# Altium project RFC_MB.PrjPcb (part 6 of 7)

## Sheet SlowChans.SchDoc
size 594 x 420 mm; Address1: Address1; Address2: Address2; Address3: Address3; Address4: Address4; SheetNumber: 1; Scale: 1:1; Разраб.: Иванов; Обозначение документа: АБВГ.123456.001 Э3; Пров.: Петров; Утв.: Сидоров; Наименование организации: ОАО "Концерн "МПО-Гидроприбор"; Перв. применение: АБВГ.123456.000; Наименование изделия 1: Плата; Наименование изделия 2: Схема электрическая; Наименование изделия 3: принципиальная; Нач. отд.: Нач. отд.; Фамилия нач. отд.: Сидоров
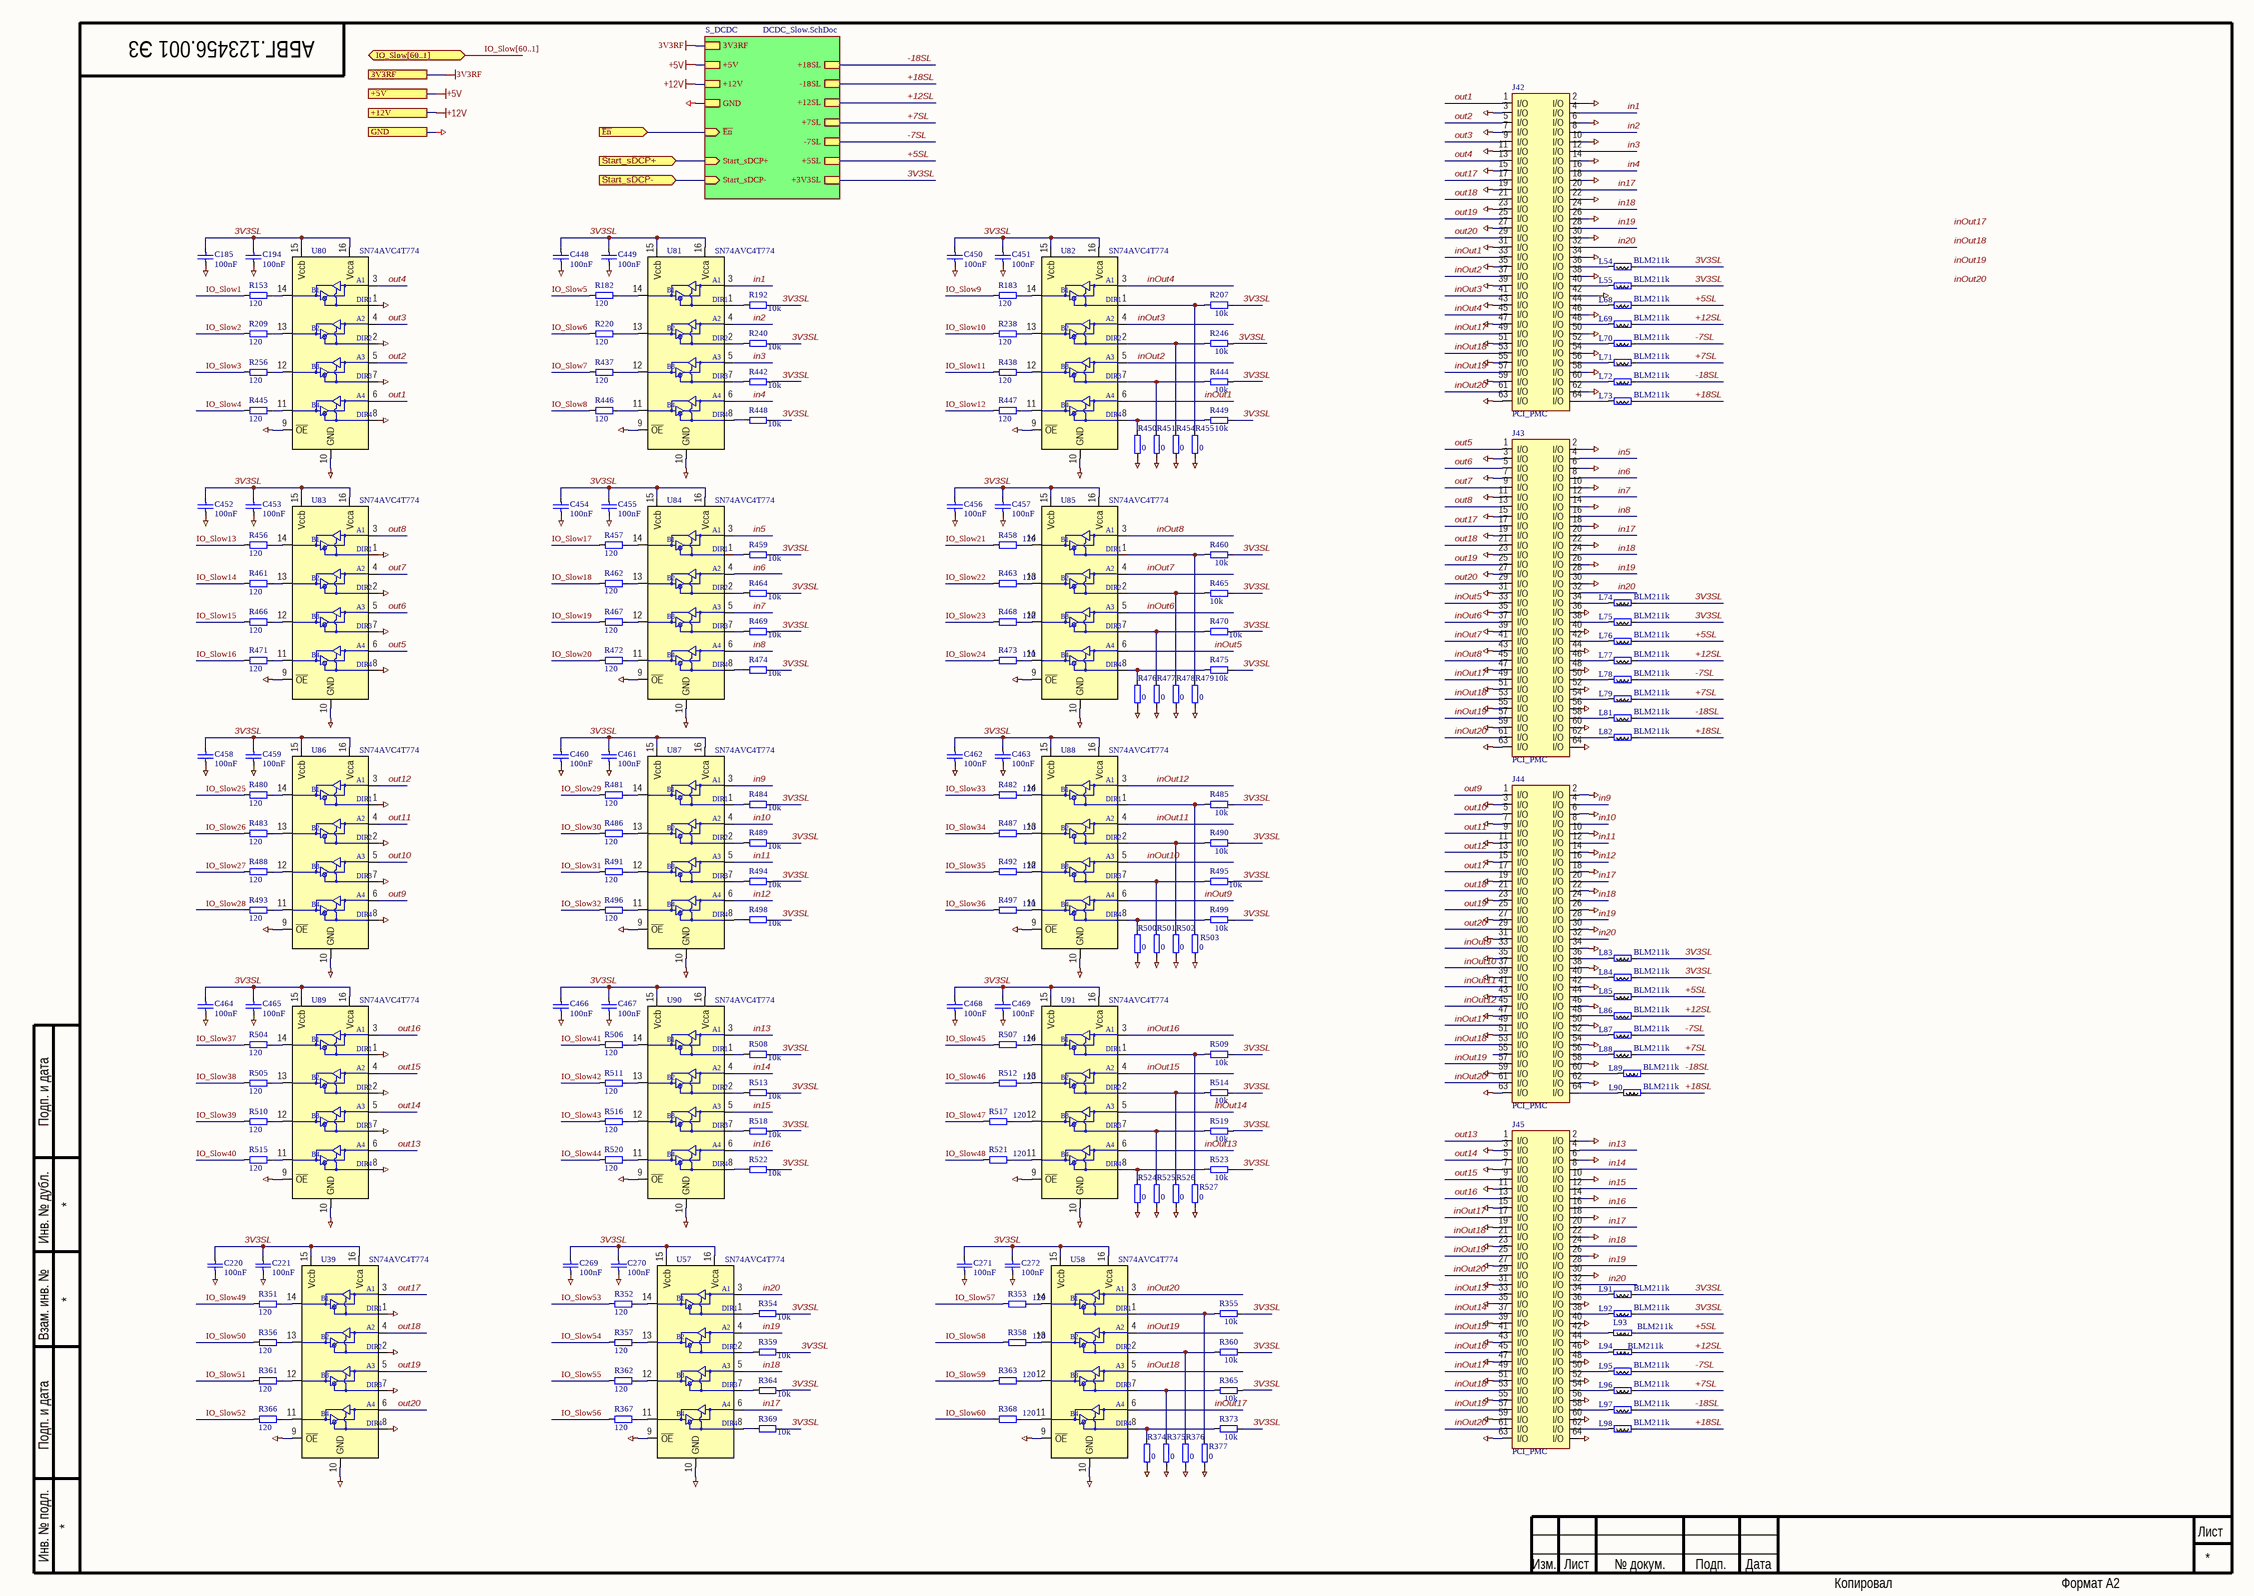
[diagram p21: SlowChans.SchDoc]

### Parts
C185  100nF  [SMD0805CAP]
C194  100nF  [SMD0805CAP]
C220  100nF  [SMD0805CAP]
C221  100nF  [SMD0805CAP]
C269  100nF  [SMD0805CAP]
C270  100nF  [SMD0805CAP]
C271  100nF  [SMD0805CAP]
C272  100nF  [SMD0805CAP]
C448  100nF  [SMD0805CAP]
C449  100nF  [SMD0805CAP]
C450  100nF  [SMD0805CAP]
C451  100nF  [SMD0805CAP]
C452  100nF  [SMD0805CAP]
C453  100nF  [SMD0805CAP]
C454  100nF  [SMD0805CAP]
C455  100nF  [SMD0805CAP]
C456  100nF  [SMD0805CAP]
C457  100nF  [SMD0805CAP]
C458  100nF  [SMD0805CAP]
C459  100nF  [SMD0805CAP]
C460  100nF  [SMD0805CAP]
C461  100nF  [SMD0805CAP]
C462  100nF  [SMD0805CAP]
C463  100nF  [SMD0805CAP]
C464  100nF  [SMD0805CAP]
C465  100nF  [SMD0805CAP]
C466  100nF  [SMD0805CAP]
C467  100nF  [SMD0805CAP]
C468  100nF  [SMD0805CAP]
C469  100nF  [SMD0805CAP]
J42  PCI_PMC  [TYCO_120521-1]
J43  PCI_PMC  [TYCO_120521-1]
J44  PCI_PMC  [TYCO_120521-1]
J45  PCI_PMC  [TYCO_120521-1]
L54  BLM211k  [RESC2012X50N]
L55  BLM211k  [RESC2012X50N]
L68  BLM211k  [RESC2012X50N]
L69  BLM211k  [RESC2012X50N]
L70  BLM211k  [RESC2012X50N]
L71  BLM211k  [RESC2012X50N]
L72  BLM211k  [RESC2012X50N]
L73  BLM211k  [RESC2012X50N]
L74  BLM211k  [RESC2012X50N]
L75  BLM211k  [RESC2012X50N]
L76  BLM211k  [RESC2012X50N]
L77  BLM211k  [RESC2012X50N]
L78  BLM211k  [RESC2012X50N]
L79  BLM211k  [RESC2012X50N]
L81  BLM211k  [RESC2012X50N]
L82  BLM211k  [RESC2012X50N]
L83  BLM211k  [RESC2012X50N]
L84  BLM211k  [RESC2012X50N]
L85  BLM211k  [RESC2012X50N]
L86  BLM211k  [RESC2012X50N]
L87  BLM211k  [RESC2012X50N]
L88  BLM211k  [RESC2012X50N]
L89  BLM211k  [RESC2012X50N]
L90  BLM211k  [RESC2012X50N]
L91  BLM211k  [RESC2012X50N]
L92  BLM211k  [RESC2012X50N]
L93  BLM211k  [RESC2012X50N]
L94  BLM211k  [RESC2012X50N]
L95  BLM211k  [RESC2012X50N]
L96  BLM211k  [RESC2012X50N]
L97  BLM211k  [RESC2012X50N]
L98  BLM211k  [RESC2012X50N]
R153  120  [SMD0805RES]
R182  120  [SMD0805RES]
R183  120  [SMD0805RES]
R192  10k  [SMD0805RES]
R207  10k  [SMD0805RES]
R209  120  [SMD0805RES]
R220  120  [SMD0805RES]
R238  120  [SMD0805RES]
R240  10k  [SMD0805RES]
R246  10k  [SMD0805RES]
R256  120  [SMD0805RES]
R351  120  [SMD0805RES]
R352  120  [SMD0805RES]
R353  120  [SMD0805RES]
R354  10k  [SMD0805RES]
R355  10k  [SMD0805RES]
R356  120  [SMD0805RES]
R357  120  [SMD0805RES]
R358  120  [SMD0805RES]
R359  10k  [SMD0805RES]
R360  10k  [SMD0805RES]
R361  120  [SMD0805RES]
R362  120  [SMD0805RES]
R363  120  [SMD0805RES]
R364  10k  [SMD0805RES]
R365  10k  [SMD0805RES]
R366  120  [SMD0805RES]
R367  120  [SMD0805RES]
R368  120  [SMD0805RES]
R369  10k  [SMD0805RES]
R373  10k  [SMD0805RES]
R374  0  [SMD0805RES]
R375  0  [SMD0805RES]
R376  0  [SMD0805RES]
R377  0  [SMD0805RES]
R437  120  [SMD0805RES]
R438  120  [SMD0805RES]
R442  10k  [SMD0805RES]
R444  10k  [SMD0805RES]
R445  120  [SMD0805RES]
R446  120  [SMD0805RES]
R447  120  [SMD0805RES]
R448  10k  [SMD0805RES]
R449  10k  [SMD0805RES]
R450  0  [SMD0805RES]
R451  0  [SMD0805RES]
R454  0  [SMD0805RES]
R455  0  [SMD0805RES]
R456  120  [SMD0805RES]
R457  120  [SMD0805RES]
R458  120  [SMD0805RES]
R459  10k  [SMD0805RES]
R460  10k  [SMD0805RES]
R461  120  [SMD0805RES]
R462  120  [SMD0805RES]
R463  120  [SMD0805RES]
R464  10k  [SMD0805RES]
R465  10k  [SMD0805RES]
R466  120  [SMD0805RES]
R467  120  [SMD0805RES]
R468  120  [SMD0805RES]
R469  10k  [SMD0805RES]
R470  10k  [SMD0805RES]
R471  120  [SMD0805RES]
R472  120  [SMD0805RES]
R473  120  [SMD0805RES]
R474  10k  [SMD0805RES]
R475  10k  [SMD0805RES]
R476  0  [SMD0805RES]
R477  0  [SMD0805RES]
R478  0  [SMD0805RES]
R479  0  [SMD0805RES]
R480  120  [SMD0805RES]
R481  120  [SMD0805RES]
R482  120  [SMD0805RES]
R483  120  [SMD0805RES]
R484  10k  [SMD0805RES]
R485  10k  [SMD0805RES]
R486  120  [SMD0805RES]
R487  120  [SMD0805RES]
R488  120  [SMD0805RES]
R489  10k  [SMD0805RES]
R490  10k  [SMD0805RES]
R491  120  [SMD0805RES]
R492  120  [SMD0805RES]
R493  120  [SMD0805RES]
R494  10k  [SMD0805RES]
R495  10k  [SMD0805RES]
R496  120  [SMD0805RES]
R497  120  [SMD0805RES]
R498  10k  [SMD0805RES]
R499  10k  [SMD0805RES]
R500  0  [SMD0805RES]
R501  0  [SMD0805RES]
R502  0  [SMD0805RES]
R503  0  [SMD0805RES]
R504  120  [SMD0805RES]
R505  120  [SMD0805RES]
R506  120  [SMD0805RES]
R507  120  [SMD0805RES]
R508  10k  [SMD0805RES]
R509  10k  [SMD0805RES]
R510  120  [SMD0805RES]
R511  120  [SMD0805RES]
R512  120  [SMD0805RES]
R513  10k  [SMD0805RES]
R514  10k  [SMD0805RES]
R515  120  [SMD0805RES]
R516  120  [SMD0805RES]
R517  120  [SMD0805RES]
R518  10k  [SMD0805RES]
R519  10k  [SMD0805RES]
R520  120  [SMD0805RES]
R521  120  [SMD0805RES]
R522  10k  [SMD0805RES]
R523  10k  [SMD0805RES]
R524  0  [SMD0805RES]
R525  0  [SMD0805RES]
R526  0  [SMD0805RES]
R527  0  [SMD0805RES]
U39  SN74AVC4T774  [TSSOP-16]
U57  SN74AVC4T774  [TSSOP-16]
U58  SN74AVC4T774  [TSSOP-16]
U80  SN74AVC4T774  [TSSOP-16]
U81  SN74AVC4T774  [TSSOP-16]
U82  SN74AVC4T774  [TSSOP-16]
U83  SN74AVC4T774  [TSSOP-16]
U84  SN74AVC4T774  [TSSOP-16]
U85  SN74AVC4T774  [TSSOP-16]
U86  SN74AVC4T774  [TSSOP-16]
U87  SN74AVC4T774  [TSSOP-16]
U88  SN74AVC4T774  [TSSOP-16]
U89  SN74AVC4T774  [TSSOP-16]
U90  SN74AVC4T774  [TSSOP-16]
U91  SN74AVC4T774  [TSSOP-16]

### Sub-sheets
S_DCDC = DCDC_Slow.SchDoc: +18SL, -18SL, +12SL, +7SL, +3V3SL, +5SL, -7SL, ~{En} (in), Start_sDCP+ (in), Start_sDCP- (in), +5V, +12V, GND, 3V3RF

### Ports
3V3RF, +5V, +12V, GND, IO_Slow[60..1] (bidir), Start_sDCP+ (in), Start_sDCP- (in), ~{En} (in)

### Nets
3V3RF: port 3V3RF, sheet S_DCDC/3V3RF
+5V: port +5V, sheet S_DCDC/+5V
+12V: port +12V, sheet S_DCDC/+12V
GND: C185.1 C194.1 C220.1 C221.1 C269.1 C270.1 C271.1 C272.1 C448.1 C449.1 C450.1 C451.1 C452.1 C453.1 C454.1 C455.1 C456.1 C457.1 C458.1 C459.1 C460.1 C461.1 C462.1 C463.1 C464.1 C465.1 C466.1 C467.1 C468.1 C469.1 J42.2(I/O) J42.3(I/O) J42.6(I/O) J42.7(I/O) J42.10(I/O) J42.11(I/O) J42.14(I/O) J42.15(I/O) J42.18(I/O) J42.19(I/O) J42.22(I/O) J42.23(I/O) J42.26(I/O) J42.27(I/O) J42.30(I/O) J42.31(I/O) J42.34(I/O) J42.35(I/O) J42.38(I/O) J42.39(I/O) J42.42(I/O) J42.43(I/O) J42.46(I/O) J42.47(I/O) J42.50(I/O) J42.51(I/O) J42.54(I/O) J42.55(I/O) J42.58(I/O) J42.59(I/O) J42.62(I/O) J42.63(I/O) J43.2(I/O) J43.3(I/O) J43.6(I/O) J43.7(I/O) J43.10(I/O) J43.11(I/O) J43.14(I/O) J43.15(I/O) J43.18(I/O) J43.19(I/O) J43.22(I/O) J43.23(I/O) J43.26(I/O) J43.27(I/O) J43.30(I/O) J43.31(I/O) J43.35(I/O) J43.36(I/O) J43.39(I/O) J43.40(I/O) J43.43(I/O) J43.44(I/O) J43.47(I/O) J43.48(I/O) J43.51(I/O) J43.52(I/O) J43.55(I/O) J43.56(I/O) J43.59(I/O) J43.60(I/O) J43.63(I/O) J43.64(I/O) J44.2(I/O) J44.3(I/O) J44.6(I/O) J44.7(I/O) J44.10(I/O) J44.11(I/O) J44.14(I/O) J44.15(I/O) J44.18(I/O) J44.19(I/O) J44.22(I/O) J44.23(I/O) J44.26(I/O) J44.27(I/O) J44.30(I/O) J44.31(I/O) J44.34(I/O) J44.35(I/O) J44.38(I/O) J44.39(I/O) J44.42(I/O) J44.43(I/O) J44.46(I/O) J44.47(I/O) J44.50(I/O) J44.51(I/O) J44.54(I/O) J44.58(I/O) J44.59(I/O) J44.62(I/O) J44.63(I/O) J45.2(I/O) J45.3(I/O) J45.6(I/O) J45.7(I/O) J45.10(I/O) J45.11(I/O) J45.14(I/O) J45.15(I/O) J45.18(I/O) J45.19(I/O) J45.22(I/O) J45.23(I/O) J45.26(I/O) J45.27(I/O) J45.30(I/O) J45.31(I/O) J45.35(I/O) J45.36(I/O) J45.39(I/O) J45.40(I/O) J45.43(I/O) J45.44(I/O) J45.47(I/O) J45.48(I/O) J45.51(I/O) J45.52(I/O) J45.55(I/O) J45.56(I/O) J45.59(I/O) J45.60(I/O) J45.63(I/O) J45.64(I/O) R374.2 R375.2 R376.2 R377.1 R450.2 R451.2 R454.2 R455.1 R476.2 R477.2 R478.2 R479.1 R500.2 R501.2 R502.2 R503.1 R524.2 R525.2 R526.2 R527.1 U39.1(DIR1) U39.2(DIR2) U39.7(DIR3) U39.8(DIR4) U39.9(~{OE}) U39.10(GND) U57.9(~{OE}) U57.10(GND) U58.9(~{OE}) U58.10(GND) U80.1(DIR1) U80.2(DIR2) U80.7(DIR3) U80.8(DIR4) U80.9(~{OE}) U80.10(GND) U81.9(~{OE}) U81.10(GND) U82.9(~{OE}) U82.10(GND) U83.1(DIR1) U83.2(DIR2) U83.7(DIR3) U83.8(DIR4) U83.9(~{OE}) U83.10(GND) U84.9(~{OE}) U84.10(GND) U85.9(~{OE}) U85.10(GND) U86.1(DIR1) U86.2(DIR2) U86.7(DIR3) U86.8(DIR4) U86.9(~{OE}) U86.10(GND) U87.9(~{OE}) U87.10(GND) U88.9(~{OE}) U88.10(GND) U89.1(DIR1) U89.2(DIR2) U89.7(DIR3) U89.8(DIR4) U89.9(~{OE}) U89.10(GND) U90.9(~{OE}) U90.10(GND) U91.9(~{OE}) U91.10(GND) ; port GND, sheet S_DCDC/GND
3V3SL: C185.2 C194.2 C220.2 C221.2 C269.2 C270.2 C271.2 C272.2 C448.2 C449.2 C450.2 C451.2 C452.2 C453.2 C454.2 C455.2 C456.2 C457.2 C458.2 C459.2 C460.2 C461.2 C462.2 C463.2 C464.2 C465.2 C466.2 C467.2 C468.2 C469.2 L54.2 L55.2 L74.2 L75.2 L83.2 L84.2 L91.2 L92.2 R192.1 R207.1 R240.1 R246.1 R354.1 R355.1 R359.1 R360.1 R364.1 R365.1 R369.1 R373.1 R442.1 R444.1 R448.1 R449.1 R459.1 R460.1 R464.1 R465.1 R469.1 R470.1 R474.1 R475.1 R484.1 R485.1 R489.1 R490.1 R494.1 R495.1 R498.1 R499.1 R508.1 R509.1 R513.1 R514.1 R518.1 R519.1 R522.1 R523.1 U39.15(Vccb) U39.16(Vcca) U57.15(Vccb) U57.16(Vcca) U58.15(Vccb) U58.16(Vcca) U80.15(Vccb) U80.16(Vcca) U81.15(Vccb) U81.16(Vcca) U82.15(Vccb) U82.16(Vcca) U83.15(Vccb) U83.16(Vcca) U84.15(Vccb) U84.16(Vcca) U85.15(Vccb) U85.16(Vcca) U86.15(Vccb) U86.16(Vcca) U87.15(Vccb) U87.16(Vcca) U88.15(Vccb) U88.16(Vcca) U89.15(Vccb) U89.16(Vcca) U90.15(Vccb) U90.16(Vcca) U91.15(Vccb) U91.16(Vcca) ; sheet S_DCDC/+3V3SL
+5SL: L68.2 L76.2 L85.2 L93.1 ; sheet S_DCDC/+5SL
+7SL: L71.2 L79.2 L88.2 L96.2 ; sheet S_DCDC/+7SL
+12SL: L69.2 L77.2 L86.2 L94.1 ; sheet S_DCDC/+12SL
+18SL: L73.2 L82.2 L90.2 L98.2 ; sheet S_DCDC/-18SL
-7SL: L70.2 L78.2 L87.2 L95.2 ; sheet S_DCDC/-7SL
-18SL: L72.2 L81.2 L89.2 L97.2 ; sheet S_DCDC/+18SL
~{En}: port ~{En}, sheet S_DCDC/~{En}
in1: J42.4(I/O) U81.3(A1)
in2: J42.8(I/O) U81.4(A2)
in3: J42.12(I/O) U81.5(A3)
in4: J42.16(I/O) U81.6(A4)
in5: J43.4(I/O) U84.3(A1)
in6: J43.8(I/O) U84.4(A2)
in7: J43.12(I/O) U84.5(A3)
in8: J43.16(I/O) U84.6(A4)
in9: J44.4(I/O) U87.3(A1)
in10: J44.8(I/O) U87.4(A2)
in11: J44.12(I/O) U87.5(A3)
in12: J44.16(I/O) U87.6(A4)
in13: J45.4(I/O) U90.3(A1)
in14: J45.8(I/O) U90.4(A2)
in15: J45.12(I/O) U90.5(A3)
in16: J45.16(I/O) U90.6(A4)
in17: J42.20(I/O) J43.20(I/O) J44.20(I/O) J45.20(I/O) U57.6(A4)
in18: J42.24(I/O) J43.24(I/O) J44.24(I/O) J45.24(I/O) U57.5(A3)
in19: J42.28(I/O) J43.28(I/O) J44.28(I/O) J45.28(I/O) U57.4(A2)
in20: J42.32(I/O) J43.32(I/O) J44.32(I/O) J45.32(I/O) U57.3(A1)
inOut1: J42.33(I/O) U82.6(A4)
inOut2: J42.37(I/O) U82.5(A3)
inOut3: J42.41(I/O) U82.4(A2)
inOut4: J42.45(I/O) U82.3(A1)
inOut5: J43.33(I/O) U85.6(A4)
inOut6: J43.37(I/O) U85.5(A3)
inOut7: J43.41(I/O) U85.4(A2)
inOut8: J43.45(I/O) U85.3(A1)
inOut9: J44.33(I/O) U88.6(A4)
inOut10: J44.37(I/O) U88.5(A3)
inOut11: J44.41(I/O) U88.4(A2)
inOut12: J44.45(I/O) U88.3(A1)
inOut13: J45.33(I/O) U91.6(A4)
inOut14: J45.37(I/O) U91.5(A3)
inOut15: J45.41(I/O) U91.4(A2)
inOut16: J45.45(I/O) U91.3(A1)
inOut17: J42.49(I/O) J43.49(I/O) J44.49(I/O) J45.17(I/O) J45.49(I/O) U58.6(A4)
inOut18: J42.53(I/O) J43.53(I/O) J44.53(I/O) J45.21(I/O) J45.53(I/O) U58.5(A3)
inOut19: J42.57(I/O) J43.57(I/O) J44.57(I/O) J45.25(I/O) J45.57(I/O) U58.4(A2)
inOut20: J42.61(I/O) J43.61(I/O) J44.61(I/O) J45.29(I/O) J45.61(I/O) U58.3(A1)
IO_Slow1: R153.2  [project net IO_BR23]
IO_Slow2: R209.2  [project net IO_BR24]
IO_Slow3: R256.2  [project net IO_BR25]
IO_Slow4: R445.2  [project net IO_BR26]
IO_Slow5: R182.2  [project net IO_BR27]
IO_Slow6: R220.2  [project net IO_BR28]
IO_Slow7: R437.2  [project net IO_BR29]
IO_Slow8: R446.2  [project net IO_BR30]
IO_Slow9: R183.2  [project net IO_BR31]
IO_Slow10: R238.2  [project net IO_BR32]
IO_Slow11: R438.2  [project net IO_BR33]
IO_Slow12: R447.2  [project net IO_BR34]
IO_Slow13: R456.2  [project net IO_BR35]
IO_Slow14: R461.2  [project net IO_BR36]
IO_Slow15: R466.2  [project net IO_CR1]
IO_Slow16: R471.2  [project net IO_CR2]
IO_Slow17: R457.2  [project net IO_CR3]
IO_Slow18: R462.1  [project net IO_CR4]
IO_Slow19: R467.2  [project net IO_CR5]
IO_Slow20: R472.2  [project net IO_CR6]
IO_Slow21: R458.2  [project net IO_CR7]
IO_Slow22: R463.2  [project net IO_CR8]
IO_Slow23: R468.2  [project net IO_CR9]
IO_Slow24: R473.2  [project net IO_CR10]
IO_Slow25: R480.2  [project net IO_CR11]
IO_Slow26: R483.2  [project net IO_CR12]
IO_Slow27: R488.2  [project net IO_CR13]
IO_Slow28: R493.2  [project net IO_CR14]
IO_Slow29: R481.2  [project net IO_CR15]
IO_Slow30: R486.2  [project net IO_CR16]
IO_Slow31: R491.2  [project net IO_CR17]
IO_Slow32: R496.2  [project net IO_CR18]
IO_Slow33: R482.2  [project net IO_CR19]
IO_Slow34: R487.2  [project net IO_CR20]
IO_Slow35: R492.2  [project net IO_CR21]
IO_Slow36: R497.2  [project net IO_CR22]
IO_Slow37: R504.2  [project net IO_CR23]
IO_Slow38: R505.2  [project net IO_CR24]
IO_Slow39: R510.2  [project net IO_CR25]
IO_Slow40: R515.2  [project net IO_CR26]
IO_Slow41: R506.2  [project net IO_CR27]
IO_Slow42: R511.2  [project net IO_CR28]
IO_Slow43: R516.2  [project net IO_CR29]
IO_Slow44: R520.2  [project net IO_CR30]
IO_Slow45: R507.2  [project net IO_CR31]
IO_Slow46: R512.2  [project net IO_CR32]
IO_Slow47: R517.2  [project net IO_CL1]
IO_Slow48: R521.2  [project net IO_CL2]
IO_Slow49: R351.2  [project net IO_CL3]
IO_Slow50: R356.2  [project net IO_CL4]
IO_Slow51: R361.2  [project net IO_CL5]
IO_Slow52: R366.2  [project net IO_CL6]
IO_Slow53: R352.2  [project net IO_CL7]
IO_Slow54: R357.2  [project net IO_CL8]
IO_Slow55: R362.2  [project net IO_CL9]
IO_Slow56: R367.2  [project net IO_CL10]
IO_Slow57: R353.2  [project net IO_CL11]
IO_Slow58: R358.2  [project net IO_CL12]
IO_Slow59: R363.2  [project net IO_CL13]
IO_Slow60: R368.2  [project net IO_CL14]
out1: J42.1(I/O) U80.6(A4)
out2: J42.5(I/O) U80.5(A3)
out3: J42.9(I/O) U80.4(A2)
out4: J42.13(I/O) U80.3(A1)
out5: J43.1(I/O) U83.6(A4)
out6: J43.5(I/O) U83.5(A3)
out7: J43.9(I/O) U83.4(A2)
out8: J43.13(I/O) U83.3(A1)
out9: J44.1(I/O) U86.6(A4)
out10: J44.5(I/O) U86.5(A3)
out11: J44.9(I/O) U86.4(A2)
out12: J44.13(I/O) U86.3(A1)
out13: J45.1(I/O) U89.6(A4)
out14: J45.5(I/O) U89.5(A3)
out15: J45.9(I/O) U89.4(A2)
out16: J45.13(I/O) U89.3(A1)
out17: J42.17(I/O) J43.17(I/O) J44.17(I/O) U39.3(A1)
out18: J42.21(I/O) J43.21(I/O) J44.21(I/O) U39.4(A2)
out19: J42.25(I/O) J43.25(I/O) J44.25(I/O) U39.5(A3)
out20: J42.29(I/O) J43.29(I/O) J44.29(I/O) U39.6(A4)
NetJ42_36: J42.36(I/O) L54.1
NetJ42_40: J42.40(I/O) L55.1
NetJ42_44: J42.44(I/O) L68.1
NetJ42_48: J42.48(I/O) L69.1
NetJ42_52: J42.52(I/O) L70.1
NetJ42_56: J42.56(I/O) L71.1
NetJ42_60: J42.60(I/O) L72.1
NetJ42_64: J42.64(I/O) L73.1
NetJ43_34: J43.34(I/O) L74.1
NetJ43_38: J43.38(I/O) L75.1
NetJ43_42: J43.42(I/O) L76.1
NetJ43_46: J43.46(I/O) L77.1
NetJ43_50: J43.50(I/O) L78.1
NetJ43_54: J43.54(I/O) L79.1
NetJ43_58: J43.58(I/O) L81.1
NetJ43_62: J43.62(I/O) L82.1
NetJ44_36: J44.36(I/O) L83.1
NetJ44_40: J44.40(I/O) L84.1
NetJ44_44: J44.44(I/O) L85.1
NetJ44_48: J44.48(I/O) L86.1
NetJ44_52: J44.52(I/O) L87.1
NetJ44_56: J44.56(I/O) L88.1
NetJ44_60: J44.60(I/O) L89.1
NetJ44_64: J44.64(I/O) L90.1
NetJ45_34: J45.34(I/O) L91.1
NetJ45_38: J45.38(I/O) L92.1
NetJ45_42: J45.42(I/O) L93.2
NetJ45_46: J45.46(I/O) L94.2
NetJ45_50: J45.50(I/O) L95.1
NetJ45_54: J45.54(I/O) L96.1
NetJ45_58: J45.58(I/O) L97.1
NetJ45_62: J45.62(I/O) L98.1
NetR153_1: R153.1 U80.14(B1)
NetR182_1: R182.1 U81.14(B1)
NetR183_1: R183.1 U82.14(B1)
NetR192_2: R192.2 U81.1(DIR1)
NetR207_2: R207.2 R455.2 U82.1(DIR1)
NetR209_1: R209.1 U80.13(B2)
NetR220_1: R220.1 U81.13(B2)
NetR238_1: R238.1 U82.13(B2)
NetR240_2: R240.2 U81.2(DIR2)
NetR246_2: R246.2 R454.1 U82.2(DIR2)
NetR256_1: R256.1 U80.12(B3)
NetR351_1: R351.1 U39.14(B1)
NetR352_1: R352.1 U57.14(B1)
NetR353_1: R353.1 U58.14(B1)
NetR354_2: R354.2 U57.1(DIR1)
NetR355_2: R355.2 R377.2 U58.1(DIR1)
NetR356_1: R356.1 U39.13(B2)
NetR357_1: R357.1 U57.13(B2)
NetR358_1: R358.1 U58.13(B2)
NetR359_2: R359.2 U57.2(DIR2)
NetR360_2: R360.2 R376.1 U58.2(DIR2)
NetR361_1: R361.1 U39.12(B3)
NetR362_1: R362.1 U57.12(B3)
NetR363_1: R363.1 U58.12(B3)
NetR364_2: R364.2 U57.7(DIR3)
NetR365_2: R365.2 R375.1 U58.7(DIR3)
NetR366_1: R366.1 U39.11(B4)
NetR367_1: R367.1 U57.11(B4)
NetR368_1: R368.1 U58.11(B4)
NetR369_2: R369.2 U57.8(DIR4)
NetR373_2: R373.2 R374.1 U58.8(DIR4)
NetR437_1: R437.1 U81.12(B3)
NetR438_1: R438.1 U82.12(B3)
NetR442_2: R442.2 U81.7(DIR3)
NetR444_2: R444.2 R451.1 U82.7(DIR3)
NetR445_1: R445.1 U80.11(B4)
NetR446_1: R446.1 U81.11(B4)
NetR447_1: R447.1 U82.11(B4)
NetR448_2: R448.2 U81.8(DIR4)
NetR449_2: R449.2 R450.1 U82.8(DIR4)
NetR456_1: R456.1 U83.14(B1)
NetR457_1: R457.1 U84.14(B1)
NetR458_1: R458.1 U85.14(B1)
NetR459_2: R459.2 U84.1(DIR1)
NetR460_2: R460.2 R479.2 U85.1(DIR1)
NetR461_1: R461.1 U83.13(B2)
NetR462_2: R462.2 U84.13(B2)
NetR463_1: R463.1 U85.13(B2)
NetR464_2: R464.2 U84.2(DIR2)
NetR465_2: R465.2 R478.1 U85.2(DIR2)
NetR466_1: R466.1 U83.12(B3)
NetR467_1: R467.1 U84.12(B3)
NetR468_1: R468.1 U85.12(B3)
NetR469_2: R469.2 U84.7(DIR3)
NetR470_2: R470.2 R477.1 U85.7(DIR3)
NetR471_1: R471.1 U83.11(B4)
NetR472_1: R472.1 U84.11(B4)
NetR473_1: R473.1 U85.11(B4)
NetR474_2: R474.2 U84.8(DIR4)
NetR475_2: R475.2 R476.1 U85.8(DIR4)
NetR480_1: R480.1 U86.14(B1)
NetR481_1: R481.1 U87.14(B1)
NetR482_1: R482.1 U88.14(B1)
NetR483_1: R483.1 U86.13(B2)
NetR484_2: R484.2 U87.1(DIR1)
NetR485_2: R485.2 R503.2 U88.1(DIR1)
NetR486_1: R486.1 U87.13(B2)
NetR487_1: R487.1 U88.13(B2)
NetR488_1: R488.1 U86.12(B3)
NetR489_2: R489.2 U87.2(DIR2)
NetR490_2: R490.2 R502.1 U88.2(DIR2)
NetR491_1: R491.1 U87.12(B3)
NetR492_1: R492.1 U88.12(B3)
NetR493_1: R493.1 U86.11(B4)
NetR494_2: R494.2 U87.7(DIR3)
NetR495_2: R495.2 R501.1 U88.7(DIR3)
NetR496_1: R496.1 U87.11(B4)
NetR497_1: R497.1 U88.11(B4)
NetR498_2: R498.2 U87.8(DIR4)
NetR499_2: R499.2 R500.1 U88.8(DIR4)
NetR504_1: R504.1 U89.14(B1)
NetR505_1: R505.1 U89.13(B2)
NetR506_1: R506.1 U90.14(B1)
NetR507_1: R507.1 U91.14(B1)
NetR508_2: R508.2 U90.1(DIR1)
NetR509_2: R509.2 R527.2 U91.1(DIR1)
NetR510_1: R510.1 U89.12(B3)
NetR511_1: R511.1 U90.13(B2)
NetR512_1: R512.1 U91.13(B2)
NetR513_2: R513.2 U90.2(DIR2)
NetR514_2: R514.2 R526.1 U91.2(DIR2)
NetR515_1: R515.1 U89.11(B4)
NetR516_1: R516.1 U90.12(B3)
NetR517_1: R517.1 U91.12(B3)
NetR518_2: R518.2 U90.7(DIR3)
NetR519_2: R519.2 R525.1 U91.7(DIR3)
NetR520_1: R520.1 U90.11(B4)
NetR521_1: R521.1 U91.11(B4)
NetR522_2: R522.2 U90.8(DIR4)
NetR523_2: R523.2 R524.1 U91.8(DIR4)
(unnamed): port Start_sDCP+, sheet S_DCDC/Start_sDCP+
(unnamed): port Start_sDCP-, sheet S_DCDC/Start_sDCP-

Not connected (* = marked no-connect by the designer): J44 55(I/O)

### Buses and harness runs
bus IO_Slow[60..1] = port IO_Slow[60..1]

### Notes on the sheet
- Labels drawn without touching a wire or pin: inOut17, inOut18, inOut19, inOut20
- Подп. и дата
- Инв. № дубл.
- Взам. инв. №
- Инв. № подл.
- Изм.
- Лист
- № докум.
- Подп.
- Дата
- Копировал
- Формат А2

### Library data of the parts
C185 C194 C220 C221 C269-C272 C448-C469 = C0805: as C206 on sheet DCP_DC_DC; Value: 100nF; Price: 2
J42-J45 = PCI_PMC_M: as J34 on sheet Integrator; Value: PCI_PMC; Vendor: TE Connectivity
L54 L55 L68-L79 L81-L98 = BLM21: as L35 on sheet Integrator; Price: 10; Device: BLM21
R153 R182 R183 R192 R207 R209 R220 R238 R240 R246 R256 R351-R369 R373-R377 R437 R438 R442 R444-R451 R454-R461 R463-R527 = R0805: as R340 on sheet Integrator; Price: 2
  R153 R182 R183 R209 R220 R238 R256 R351-R353 R356-R358 R361-R363 R366-R368 R437 R438 R445-R447 R456-R458 R461 R463 R466-R468 R471-R473 R480-R483 R486-R488 R491-R493 R496 R497 R504-R507 R510-R512 R515-R517 R520 R521: Value: 120
  R192 R207 R240 R246 R354 R355 R359 R360 R364 R365 R369 R373 R442 R444 R448 R449 R459 R460 R464 R465 R469 R470 R474 R475 R484 R485 R489 R490 R494 R495 R498 R499 R508 R509 R513 R514 R518 R519 R522 R523: Value: 10k
  R374-R377 R450 R451 R454 R455 R476-R479 R500-R503 R524-R527: Value: 0
R462 = R0805: as R233 on sheet DCP_DC_DC; Price: 2; Value: 120
U39 U57 U58 U80-U91 = SN74AVC4T774: as U42 on sheet DDS; Device: SN74AVC4T774; Price: 300